# Altium schematic sheet powerReg.SchDoc
size A4; SheetNumber: 4; SheetTotal: 4
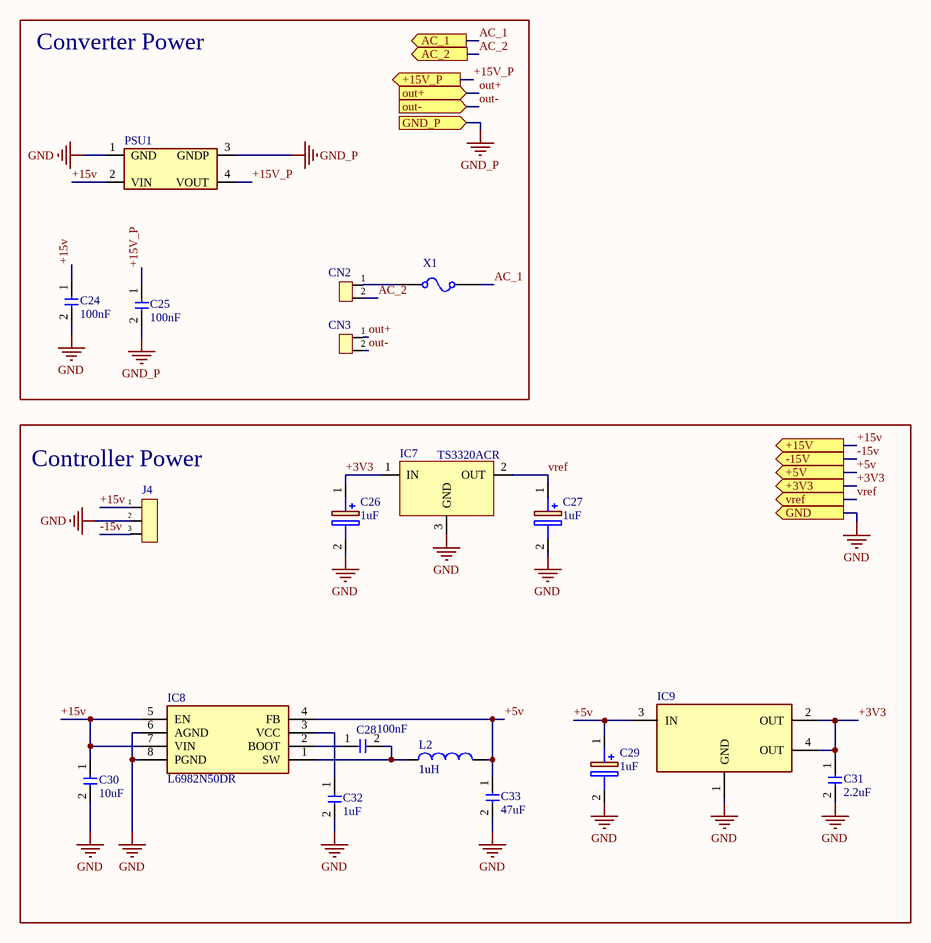
[diagram p0: powerReg.SchDoc]

## Parts
C24  100nF  [CAPACITOR_0805]
C25  100nF  [CAPACITOR_0805]
C26  1uF  [Capacitor 0805 polaryzed]
C27  1uF  [Capacitor 0805 polaryzed]
C28  100nF  [CAPACITOR_0805]
C29  1uF  [Capacitor 0805 polaryzed]
C30  10uF  [CAPACITOR_0805]
C31  2.2uF  [CAPACITOR_0805]
C32  1uF  [CAPACITOR_0805]
C33  47uF  [CAPACITOR_1210]
CN2  conector 2Pin  [NC6P10802]  (value not drawn)
CN3  conector 2Pin  [NC6P10802]  (value not drawn)
IC7  TS3320ACR  [SOT323]
IC8  L6982N50DR  [SO-8]
IC9  Linear Regulator  [SOT-223-4]  (value not drawn)
J4  Conector 1x3P  [Conector 1x3 Screw]  (value not drawn)
L2  1uH  value 1u  [Inductor 1005]
PSU1  PDSE1-S15-S15-S  [PDSE1-S15-S15-S]  (value not drawn)
X1  Fuse  [Fuse 1206]  (value not drawn)

## Blocks framed on the sheet
Converter Power: C24 C25 CN2 CN3 PSU1 X1
Controller Power: C26-C33 IC7-IC9 J4 L2

## Ports
+3V3 (out, see pfc[2B], uController[4A]), +5V (out, see pfc[2B], converter[4C], uController[4A]), +15V (out, see pfc[2B], converter[4C], uController[4C]), +15V_P (out, see pfc[2B], converter[4A]), -15V (out, see pfc[2B], converter[4C]), AC_1 (out, see pfc[2A], converter[2A]), AC_2 (out, see pfc[2B], converter[2A]), GND (out, see pfc[2B], converter[4B], uController[4A]), GND_P (in, see pfc[1A], converter[2A]), out+ (in, see pfc[1B], converter[2B]), out- (in, see pfc[1B], converter[2B]), vref (out, see pfc[2B], uController[4A])

## Nets
GND: C24.2 C26.2(-) C27.2(-) C29.2(-) C30.2 C31.2 C32.2 C33.2 IC7.3(GND) IC8.6(AGND) IC8.8(PGND) IC9.1(GND) J4.2 PSU1.1(GND) ; port GND
GND_P: C25.2 PSU1.3(GNDP) ; port GND_P
+3V3: C26.1(+) C31.1 IC7.1(IN) IC9.2(OUT) IC9.4(OUT) ; port +3V3
+5v: C29.1(+) C33.1 IC8.4(FB) IC9.3(IN) L2.2 ; port +5V
+15v: C24.1 C30.1 IC8.5(EN) IC8.7(VIN) J4.1 PSU1.2(VIN) ; port +15V
+15V_P: C25.1 PSU1.4(VOUT) ; port +15V_P
-15v: J4.3 ; port -15V
AC_1: X1.2 ; port AC_1
AC_2: CN2.2 ; port AC_2
out+: CN3.1 ; port out+
out-: CN3.2 ; port out-
vref: C27.1(+) IC7.2(OUT) ; port vref
NetC28_1: C28.1 IC8.2(BOOT)
NetC28_2: C28.2 IC8.1(SW) L2.1
NetC32_1: C32.1 IC8.3(VCC)
NetCN2_1: CN2.1 X1.1

## Library data of the parts
C24 C25 C28 C30-C33 = Capacitor
C26 C27 C29 = Capacitor polaryzed
L2 = Inductor: SimulationGenericComponent: True
X1 = Fuse: RESISTANCE: 1m; SimulationGenericComponent: True; CURRENT: 1